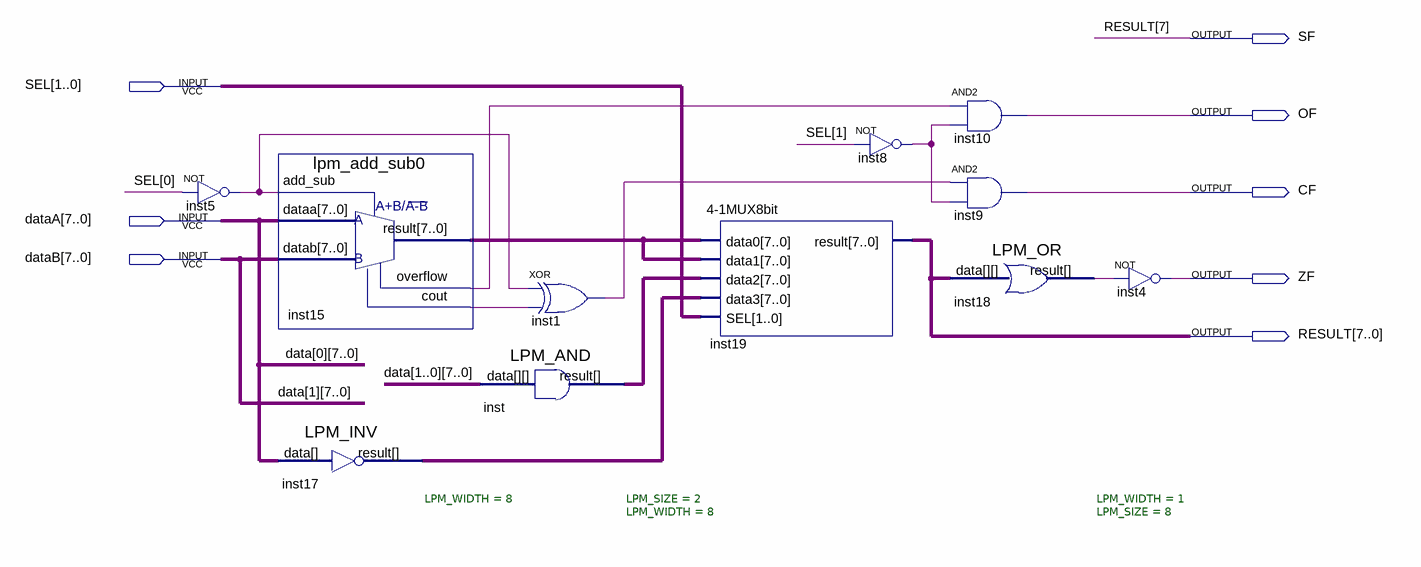
[diagram p0: schematic sheet]
// Quartus schematic ALU.bdf as structural Verilog: 11 symbols, 8 pins
module ALU (
  input  [1:0] SEL,
  input  [7:0] dataA,
  input  [7:0] dataB,
  output SF,
  output OF,
  output CF,
  output ZF,
  output [7:0] RESULT
);

  wire inst1_out, inst5_out, inst8_out, inst15_cout, inst15_overflow, inst18_result;
  wire [7:0] inst15_result, inst17_result, inst_result;

  not inst5 (inst5_out, SEL[0]);
  lpm_add_sub0 inst15 (
    .add_sub(inst5_out), .dataa(dataA), .datab(dataB), .result(inst15_result), .overflow(inst15_overflow),
    .cout(inst15_cout));
  LPM_INV #(.LPM_WIDTH(8)) inst17 (.data(dataA), .result(inst17_result));
  xor inst1 (inst1_out, inst5_out, inst15_cout);
  LPM_AND #(.LPM_SIZE(2), .LPM_WIDTH(8)) inst (.data({dataB, dataA}), .result(inst_result));
  \4-1MUX8bit  inst19 (
    .data0(inst15_result), .data1(inst15_result), .data2(inst_result), .data3(inst17_result), .SEL(SEL),
    .result(RESULT));
  not inst8 (inst8_out, SEL[1]);
  and inst10 (OF, inst15_overflow, inst8_out);
  and inst9 (CF, inst1_out, inst8_out);
  LPM_OR #(.LPM_WIDTH(1), .LPM_SIZE(8)) inst18 (.data(RESULT), .result(inst18_result));
  not inst4 (ZF, inst18_result);

  assign SF = RESULT[7];

  // Other names for the same wires on the sheet: data_0[7:0] = dataA; data_1[7:0] = dataB
endmodule
